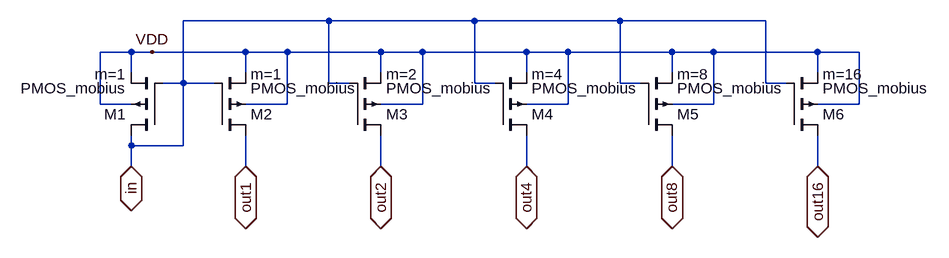
[diagram p0: schematic pMOS_currentMirror_array.asc]
pMOS_currentMirror_array.asc, the LTspice schematic file:
Version 4
SHEET 1 1552 680
WIRE 640 112 416 112
WIRE 864 112 640 112
WIRE 1088 112 864 112
WIRE 1312 112 1088 112
WIRE 336 160 288 160
WIRE 368 160 336 160
WIRE 512 160 368 160
WIRE 576 160 512 160
WIRE 720 160 576 160
WIRE 784 160 720 160
WIRE 944 160 784 160
WIRE 1008 160 944 160
WIRE 1168 160 1008 160
WIRE 1232 160 1168 160
WIRE 1392 160 1232 160
WIRE 1456 160 1392 160
WIRE 336 192 336 160
WIRE 512 192 512 160
WIRE 720 192 720 160
WIRE 944 192 944 160
WIRE 1168 192 1168 160
WIRE 1392 192 1392 160
WIRE 416 208 416 112
WIRE 416 208 384 208
WIRE 464 208 416 208
WIRE 640 208 640 112
WIRE 672 208 640 208
WIRE 864 208 864 112
WIRE 896 208 864 208
WIRE 1088 208 1088 112
WIRE 1120 208 1088 208
WIRE 1312 208 1312 112
WIRE 1344 208 1312 208
WIRE 288 240 288 160
WIRE 336 240 288 240
WIRE 576 240 576 160
WIRE 576 240 512 240
WIRE 784 240 784 160
WIRE 784 240 720 240
WIRE 1008 240 1008 160
WIRE 1008 240 944 240
WIRE 1232 240 1232 160
WIRE 1232 240 1168 240
WIRE 1456 240 1456 160
WIRE 1456 240 1392 240
WIRE 336 304 336 288
WIRE 416 304 416 208
WIRE 416 304 336 304
WIRE 336 336 336 304
WIRE 512 336 512 288
WIRE 720 336 720 288
WIRE 944 336 944 288
WIRE 1168 336 1168 288
WIRE 1392 336 1392 288
FLAG 368 160 VDD
FLAG 336 336 in
IOPIN 336 336 BiDir
FLAG 512 336 out1
IOPIN 512 336 BiDir
FLAG 720 336 out2
IOPIN 720 336 BiDir
FLAG 944 336 out4
IOPIN 944 336 BiDir
FLAG 1168 336 out8
IOPIN 1168 336 BiDir
FLAG 1392 336 out16
IOPIN 1392 336 BiDir
DATAFLAG 1168 112 "$"
SYMBOL pmos4 384 288 R180
WINDOW 123 56 94 Left 2
SYMATTR Value2 m=1
SYMATTR InstName M1
SYMATTR Value PMOS_mobius
SYMATTR Prefix X
SYMBOL pmos4 464 288 M180
WINDOW 123 56 94 Left 2
SYMATTR Value2 m=1
SYMATTR InstName M2
SYMATTR Value PMOS_mobius
SYMATTR Prefix X
SYMBOL pmos4 672 288 M180
WINDOW 123 56 94 Left 2
SYMATTR Value2 m=2
SYMATTR InstName M3
SYMATTR Value PMOS_mobius
SYMATTR Prefix X
SYMBOL pmos4 896 288 M180
WINDOW 123 56 94 Left 2
SYMATTR Value2 m=4
SYMATTR InstName M4
SYMATTR Value PMOS_mobius
SYMATTR Prefix X
SYMBOL pmos4 1120 288 M180
WINDOW 123 56 94 Left 2
SYMATTR Value2 m=8
SYMATTR InstName M5
SYMATTR Value PMOS_mobius
SYMATTR Prefix X
SYMBOL pmos4 1344 288 M180
WINDOW 123 56 94 Left 2
SYMATTR Value2 m=16
SYMATTR InstName M6
SYMATTR Value PMOS_mobius
SYMATTR Prefix X

The netlist it stands for:
* pMOS_currentMirror_array.asc
XM1 in in VDD VDD PMOS_mobius m=1  ; pins D G S B
XM2 out1 in VDD VDD PMOS_mobius m=1  ; pins D G S B
XM3 out2 in VDD VDD PMOS_mobius m=2  ; pins D G S B
XM4 out4 in VDD VDD PMOS_mobius m=4  ; pins D G S B
XM5 out8 in VDD VDD PMOS_mobius m=8  ; pins D G S B
XM6 out16 in VDD VDD PMOS_mobius m=16  ; pins D G S B
.backanno
.end